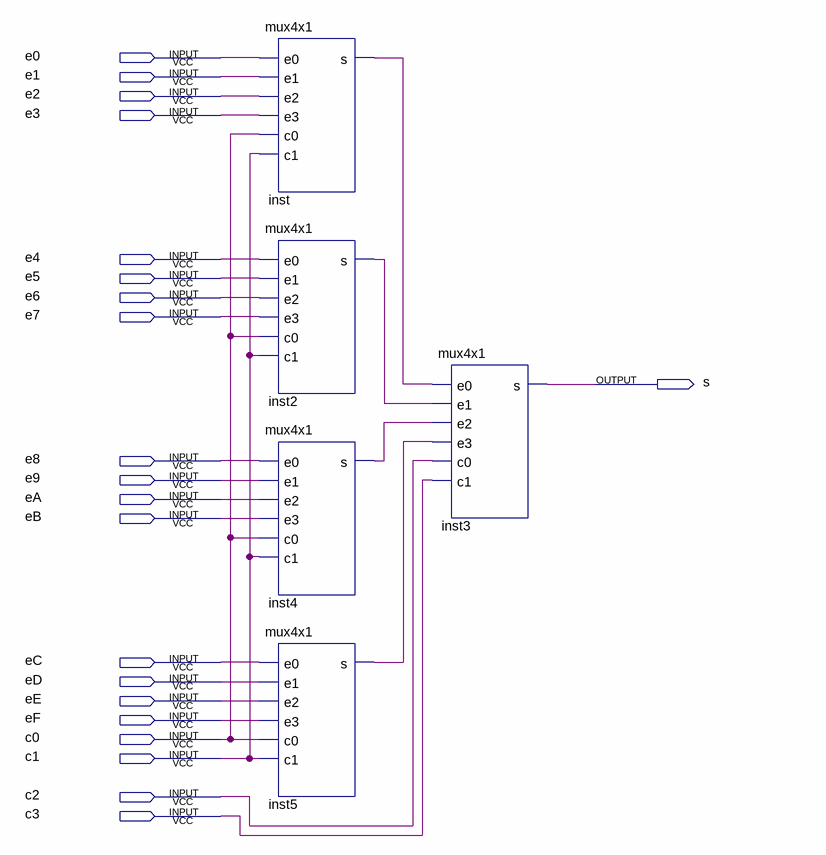
[diagram p0: schematic sheet]
// Quartus schematic mux16x1.bdf as structural Verilog: 5 symbols, 21 pins
module mux16x1 (
  input  e0,
  input  e1,
  input  e2,
  input  e3,
  input  e4,
  input  e5,
  input  e6,
  input  e7,
  input  e8,
  input  e9,
  input  eA,
  input  eB,
  input  eC,
  input  eD,
  input  eE,
  input  eF,
  input  c0,
  input  c1,
  input  c2,
  input  c3,
  output s
);

  wire inst2_s, inst4_s, inst5_s, inst_s;

  mux4x1 inst (.e0(e0), .e1(e1), .e2(e2), .e3(e3), .c0(c0), .c1(c1), .s(inst_s));
  mux4x1 inst2 (.e0(e4), .e1(e5), .e2(e6), .e3(e7), .c0(c0), .c1(c1), .s(inst2_s));
  mux4x1 inst4 (.e0(e8), .e1(e9), .e2(eA), .e3(eB), .c0(c0), .c1(c1), .s(inst4_s));
  mux4x1 inst5 (.e0(eC), .e1(eD), .e2(eE), .e3(eF), .c0(c0), .c1(c1), .s(inst5_s));
  mux4x1 inst3 (.e0(inst_s), .e1(inst2_s), .e2(inst4_s), .e3(inst5_s), .c0(c2), .c1(c3), .s(s));
endmodule
